# Altium schematic sheet USB_CY7C68001-56LFC.SchDoc: High-Speed USB 2.0 Controller
size A4; Organization: Altium Limited.; Address1: Level 3, 12a Rodborough Rd; Address2: Frenchs Forest 2086; Address3: NSW; Address4: AUSTRALIA; DocumentNumber: 49; SheetNumber: 50; SheetTotal: 78
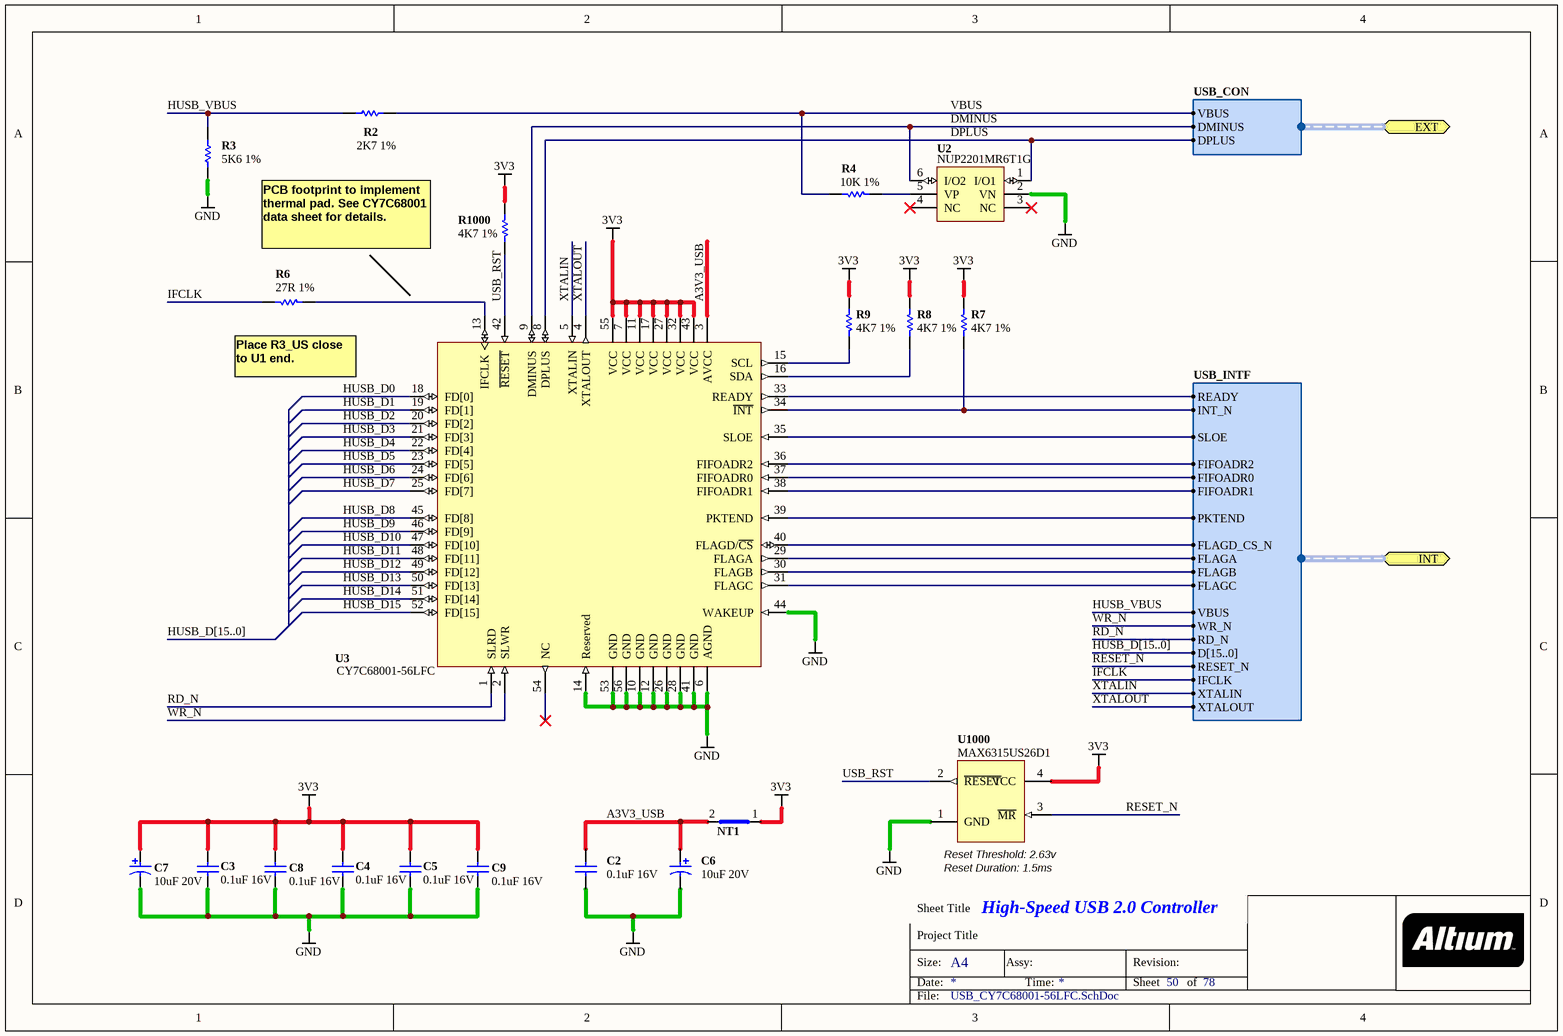
[diagram p0: USB_CY7C68001-56LFC.SchDoc]

## Parts
C2  0.1uF 16V  [CAPC1005-STAR]
C3  0.1uF 16V  [CAPC1005-STAR]
C4  0.1uF 16V  [CAPC1005-STAR]
C5  0.1uF 16V  [CAPC1005-STAR]
C6  10uF 20V  [CAPC3528-STAR]
C7  10uF 20V  [CAPC3528-STAR]
C8  0.1uF 16V  [CAPC1005-STAR]
C9  0.1uF 16V  [CAPC1005-STAR]
NT1  Net Tie SMT2  [NETTIE-SMT2-31X51]  (value not drawn)  (net tie, no BOM)
R2  2K7 1%  [RESC1005-STAR]
R3  5K6 1%  [RESC1005-STAR]
R4  10K 1%  [RESC1005-STAR]
R6  27R 1%  [RESC1005-STAR]
R7  4K7 1%  [RESC1005-STAR]
R8  4K7 1%  [RESC1005-STAR]
R9  4K7 1%  [RESC1005-STAR]
R1000  4K7 1%  [RESC1005-STAR]
U2  NUP2201MR6T1G  [TSOP95P275-6]
U3  CY7C68001-56LFC  [QFN50P800X800_HS-57]
U1000  MAX6315US26D1  [SOT143]

## Ports
EXT (harness USB_CON), INT (harness USB_INTF)

## Harnesses
USB_INTF: READY, INT_N, SLOE, FIFOADR2, FIFOADR0, FIFOADR1, PKTEND, FLAGD_CS_N, FLAGA, FLAGB, FLAGC, WR_N, RD_N, D[15..0], RESET_N, IFCLK, XTALIN, VBUS, XTALOUT
USB_CON: VBUS, DMINUS, DPLUS

## Nets
3V3: C3.2 C4.2 C5.2 C7.1 C8.1 C9.1 NT1.1(Net1) R7.2 R8.1 R9.1 R1000.2 U3.7(VCC) U3.11(VCC) U3.17(VCC) U3.27(VCC) U3.32(VCC) U3.43(VCC) U3.55(VCC) U1000.4(VCC)
GND: C2.1 C3.1 C4.1 C5.1 C6.2 C7.2 C8.2 C9.2 R3.2 U2.2(VN) U3.6(AGND) U3.10(GND) U3.12(GND) U3.14(Reserved) U3.26(GND) U3.28(GND) U3.41(GND) U3.44(WAKEUP) U3.53(GND) U3.56(GND) U1000.1(GND)
A3V3_USB: C2.2 C6.1 NT1.2(Net2) U3.3(AVCC)
DMINUS: U2.6(I/O2) U3.9(DMINUS) ; port EXT.DMINUS
DPLUS: U2.1(I/O1) U3.8(DPLUS) ; port EXT.DPLUS
HUSB_D0: U3.18(FD[0])
HUSB_D1: U3.19(FD[1])
HUSB_D2: U3.20(FD[2])
HUSB_D3: U3.21(FD[3])
HUSB_D4: U3.22(FD[4])
HUSB_D5: U3.23(FD[5])
HUSB_D6: U3.24(FD[6])
HUSB_D7: U3.25(FD[7])
HUSB_D8: U3.45(FD[8])
HUSB_D9: U3.46(FD[9])
HUSB_D10: U3.47(FD[10])
HUSB_D11: U3.48(FD[11])
HUSB_D12: U3.49(FD[12])
HUSB_D13: U3.50(FD[13])
HUSB_D14: U3.51(FD[14])
HUSB_D15: U3.52(FD[15])
HUSB_VBUS: R2.1 R3.1 ; port INT.VBUS
IFCLK: R6.1 ; port INT.IFCLK
RD_N: U3.1(SLRD) ; port INT.RD_N
RESET_N: U1000.3(~{MR}) ; port INT.RESET_N
USB_RST: R1000.1 U3.42(~{RESET}) U1000.2(~{RESET})
VBUS: R2.2 R4.1 ; port EXT.VBUS
WR_N: U3.2(SLWR) ; port INT.WR_N
XTALIN: U3.5(XTALIN) ; port INT.XTALIN
XTALOUT: U3.4(XTALOUT) ; port INT.XTALOUT
NetR4_2: R4.2 U2.5(VP)
NetR6_2: R6.2 U3.13(IFCLK)
NetR7_1: R7.1 U3.34(~{INT}) ; port INT.INT_N
NetR8_2: R8.2 U3.16(SDA)
NetR9_2: R9.2 U3.15(SCL)
NetU3_29: U3.29(FLAGA) ; port INT.FLAGA
NetU3_30: U3.30(FLAGB) ; port INT.FLAGB
NetU3_31: U3.31(FLAGC) ; port INT.FLAGC
NetU3_33: U3.33(READY) ; port INT.READY
NetU3_35: U3.35(SLOE) ; port INT.SLOE
NetU3_36: U3.36(FIFOADR2) ; port INT.FIFOADR2
NetU3_37: U3.37(FIFOADR0) ; port INT.FIFOADR0
NetU3_38: U3.38(FIFOADR1) ; port INT.FIFOADR1
NetU3_39: U3.39(PKTEND) ; port INT.PKTEND
NetU3_40: U3.40(FLAGD/~{CS}) ; port INT.FLAGD_CS_N

Not connected (* = marked no-connect by the designer): U2 3(NC)* 4(NC)*; U3 54(NC)*

## Buses and harness runs
bus HUSB_D[15..0]

## Notes on the sheet
- PCB footprint to implement thermal pad. See CY7C68001 data sheet for details.
- (near R6) Place R3_US close to U1 end.
- (near U1000) Reset Threshold: 2.63v
- (near U1000) Reset Duration: 1.5ms
- Sheet Title
- Project Title
- Size:
- Date:
- A4
- Assy:
- Time:
- Revision:
- Sheet
- of
- File:

## Library data of the parts
C2-C5 C8 C9 = D-101-0080: Capacitor, Ceramic, 0.1uF 10% 16V 0402 (1005) X7R; Polarity: Non-Polarized; Category: Capacitor; Capacitance: 0.1 uF; Dielectric: X7R; Mounting Technology: Surface Mount; Rated Voltage: 16 V; Status: Production; Technology: Ceramic; Tolerance: 10 %
C6 C7 = D-101-0007: Capacitor, Tantalum, 10uF 10% 20V MCCT-B (3528); Polarity: Polarized; Category: Capacitor; Capacitance: 10 uF; Mounting Technology: Surface Mount; Rated Voltage: 20 V; Status: Production; Technology: Tantalum; Tolerance: 10 %
NT1 = D-002-0003: Net-Tie, Surface Mount, 2 x 1.6mm x 0.8mm SMT Pads - For 0.8mm Track; Category: Net-Tie; Status: Production
R2 = D-100-0105: Resistor, 2K7 1% 0402 (1005); Power Rating: 63 mW; Resistance: 2.7 K; Category: Resistor; Mounting Technology: Surface Mount; Status: Production; Tolerance: 1 %
R3 = D-100-0086: Resistor, 5K6 1% 0402 (1005); Power Rating: 63 mW; Resistance: 5.6 K; Category: Resistor; Mounting Technology: Surface Mount; Status: Production; Tolerance: 1 %
R4 = D-100-0130: Resistor, 10K 1% 0402 (1005); Power Rating: 63 mW; Category: Resistor; Mounting Technology: Surface Mount; Resistance: 10 K; Status: Production; Tolerance: 1 %
R6 = D-100-0108: Resistor, 27R 1% 0402 (1005); Power Rating: 63 mW; Category: Resistor; Mounting Technology: Surface Mount; Resistance: 27 R; Status: Production; Tolerance: 1 %
R7-R9 R1000 = D-100-0088: Resistor, 4K7 1% 0402 (1005); Power Rating: 63 mW; Resistance: 4.7 K; Category: Resistor; Mounting Technology: Surface Mount; Status: Production; Tolerance: 1 %
U2 = D-204-0001: NUP2201MR6, Low Capacitance Diode Array, USB Protection; Max Input Voltage: mV; Max Output Current: mA; Category: IC-Power; Max Output Voltage: mV; Min Input Voltage: mV; Min Output Voltage: mV; Mounting Technology: Surface Mount; Status: Production; Supply Voltage: mV
U3 = D-221-0004: CY7C68001-56LFC, EZ-USB SX2 High-Speed USB Interface; Comm Standard: None; Category: IC-Communication; Mounting Technology: Surface Mount; Status: Production
U1000 = D-243-0000: MAX6315, Open-Drain Output SOT Reset IC, Customized Reset Thresholds, Timeout Delays; Category: IC-Other; Status: Production